# EAGLE design IRIO2 (EAGLE 6.5.0)
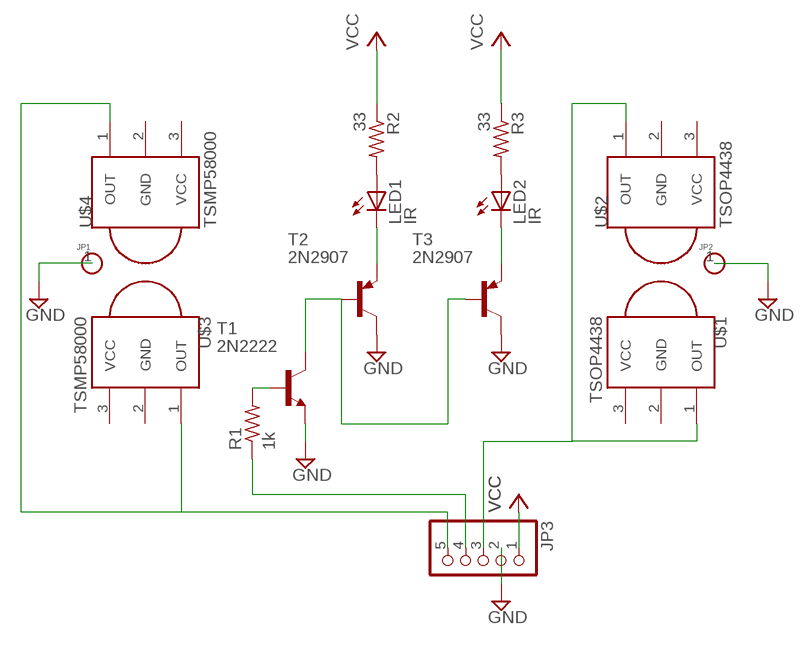
[diagram p0: schematic, sheet 1]

## Parts
JP1  HOLE-DEV  [HOLE-PAH]
JP2  HOLE-DEV  [HOLE-PAH]
JP3  PINHD-1X5  [1X05]
LED1  IR  LED3MM  [LED3MM]
LED2  IR  LED3MM  [LED3MM]
R1  1k  R-US_0207/10  [0207/10]
R2  33  R-US_0204/2V  [0204V]
R3  33  R-US_0204/2V  [0204V]
T1  2N2222  [TO92-EBC-OVAL]
T2  2N2907  [TO92-EBC-OVAL]
T3  2N2907  [TO92-EBC-OVAL]
U$1  TSOP4438  PNA460XM  [PNA460XM]
U$2  TSOP4438  PNA460XM  [PNA460XM]
U$3  TSMP58000  PNA460XM  [PNA460XM]
U$4  TSMP58000  PNA460XM  [PNA460XM]

## Nets
GND: JP1.1 JP2.1 JP3.2 T1.E T2.C T3.C
N$2: JP3.5 U$3.1(OUT) U$4.1(OUT)
N$3: T1.C T2.B T3.B
N$4: R1.2 T1.B
N$5: LED2.K(C) T3.E
N$7: LED1.K(C) T2.E
N$10: LED2.A R3.2
N$11: LED1.A R2.2
N$12: JP3.3 U$1.1(OUT) U$2.1(OUT)
N$14: JP3.4 R1.1
VCC: JP3.1 R2.1 R3.1

## Power pins joined to a net without a drawn wire
GND: U$1.2(GND) U$2.2(GND) U$3.2(GND) U$4.2(GND)
VCC: U$1.3(VCC) U$2.3(VCC) U$3.3(VCC) U$4.3(VCC)

## Library data of the parts
JP1 JP2 = cyborg5:HOLE-DEV: HOLE A hole that you can solder something into.
JP3 = pinhead:PINHD-1X5: PIN HEADER
LED1 LED2 = led:LED: LED OSRAM: - CHIPLED LG R971, LG N971, LY N971, LG Q971, LY Q971, LO R971, LY R971 LH N974, LH R974 LS Q976, LO Q976, LY Q976 LO Q996 - Hyper CHIPLED LW Q18S LB Q993, LB Q99A, LB R99A - SideLED LS A670, LO A670, LY A670, LG A670, LP A670 LB A673, LV A673, LT A673, LW A673 LH A674 LY A675 LS A676, LA A676, LO A676, LY A676, LW A676 LS A679, LY A679, LG A679 - Hyper Micro SIDELED® LS Y876, LA Y876, LO Y876, LY Y876 LT Y87S - SmartLED LW L88C, LW L88S LB L89C, LB L89S, LG L890 LS L89K, LO L89K, LY L89K LS L896, LA L896, LO L896, LY L896 - TOPLED LS T670, LO T670, LY T670, LG T670, LP T670 LSG T670, LSP T670, LSY T670, LOP T670, LYG T670 LG T671, LOG T671, LSG T671 LB T673, LV T673, LT T673, LW T673 LH T674 LS T676, LA T676, LO T676, LY T676, LB T676, LH T676, LSB T676, LW T676 LB T67C, LV T67C, LT T67C, LS T67K, LO T67K, LY T67K, LW E67C LS E67B, LA E67B, LO E67B, LY E67B, LB E67C, LV E67C, LT E67C LW T67C LS T679, LY T679, LG T679 LS T770, LO T770, LY T770, LG T770, LP T770 LB T773, LV T773, LT T773, LW T773 LH T774 LS E675, LA E675, LY E675, LS T675 LS T776, LA T776, LO T776, LY T776, LB T776 LHGB T686 LT T68C, LB T68C - Hyper Mini TOPLED® LB M676 - Mini TOPLED Santana® LG M470 LS M47K, LO M47K, LY M47K Source: http://www.osram.convergy.de LUXEON: - LUMILED® LXK2-PW12-R00, LXK2-PW12-S00, LXK2-PW14-U00, LXK2-PW14-V00 LXK2-PM12-R00, LXK2-PM12-S00, LXK2-PM14-U00 LXK2-PE12-Q00, LXK2-PE12-R00, LXK2-PE12-S00, LXK2-PE14-T00, LXK2-PE14-U00 LXK2-PB12-K00, LXK2-PB12-L00, LXK2-PB12-M00, LXK2-PB14-N00, LXK2-PB14-P00, LXK2-PB14-Q00 LXK2-PR12-L00, LXK2-PR12-M00, LXK2-PR14-Q00, LXK2-PR14-R00 LXK2-PD12-Q00, LXK2-PD12-R00, LXK2-PD12-S00 LXK2-PH12-R00, LXK2-PH12-S00 LXK2-PL12-P00, LXK2-PL12-Q00, LXK2-PL12-R00 Source: www.luxeon.com KINGBRIGHT: KA-3528ASYC Source: www.kingbright.com
R1-R3 = resistor:R-US_: RESISTOR, American symbol
T1 = adafruit:2N2222: NPN TRANSISTOR Big oval pads
T2 T3 = adafruit:2N2907*: PNP Transistor Big Oval pads
U$1-U$4 = adafruit:PNA460XM: IR 38KHz receiver PNA4602 and related receivers http://www.ladyada.net/library/pcb/eaglelibrary.html

## Board
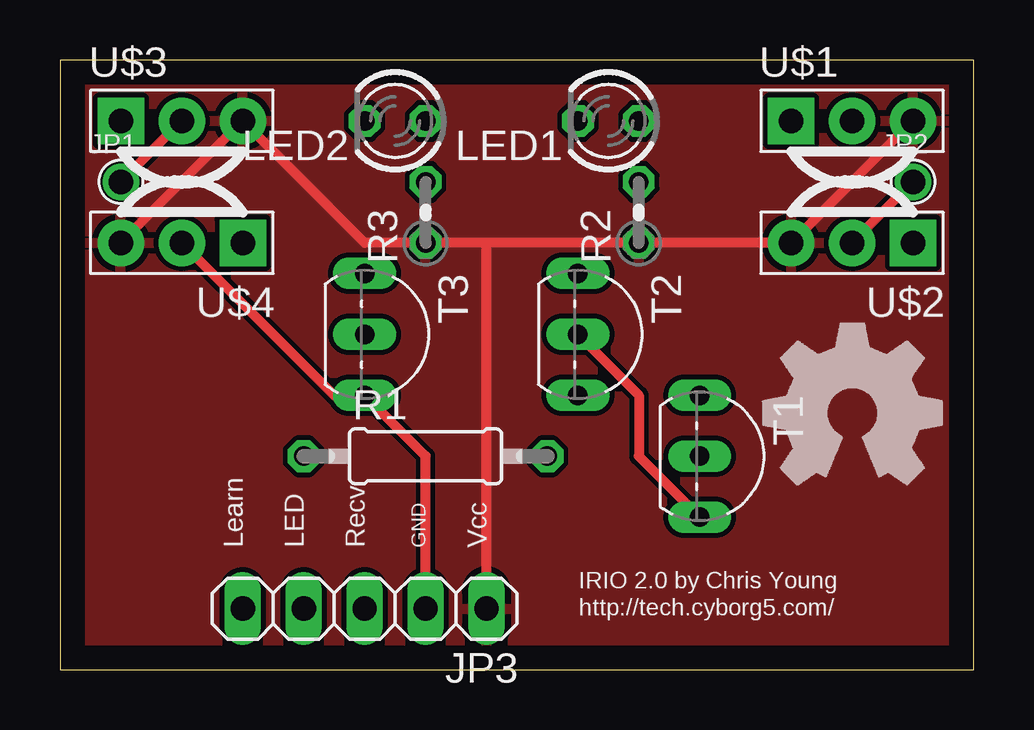
[diagram p1: board, top side]
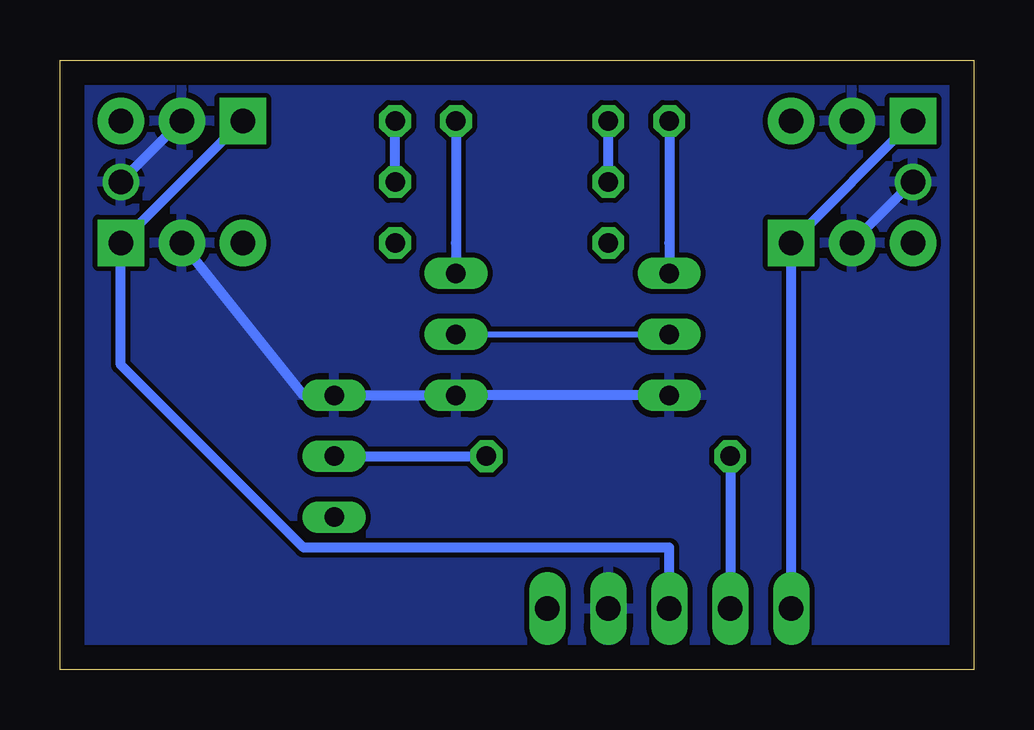
[diagram p2: board, bottom side, seen from below]

Size 38.1 x 25.4 mm. Coordinates in mm from the lower left corner, seen from the top.
Outline: 0,25.4 0,0 38.1,0 38.1,25.4 0,25.4
Copper layers (1*16): Top 0.035mm / dielectric 1.5mm / Bottom 0.035mm
Design rules "default *": minimum track width 10mil, minimum drill 24mil, track to track 8mil, track to pad 8mil, pad to pad 8mil, via to via 8mil, smd to smd 8mil, copper to edge 40mil, drill to drill 8mil, minimum pad ring 10mil, minimum via ring 8mil, stop-mask expansion 4mil, vias tented up to drill 0mil, thermal gap 10mil

### Footprints (pad centres in the part's own frame; a part is rotated, then mirrored left to right if it is on the bottom)
HOLE-PAH = drill 1.016: 1 0,0
1X05 = drill 1.016 long: 1 -5.08,0; 2 -2.54,0; 3 0,0; 4 2.54,0; 5 5.08,0
LED3MM = drill 0.813 octagon: A -1.27,0; K 1.27,0
0207/10 = drill 0.813 octagon: 1 -5.08,0; 2 5.08,0
0204V = drill 0.813 octagon: 1 -1.27,0; 2 1.27,0
TO92-EBC-OVAL = drill 0.813 long: B 0,-1.27; C 2.54,-1.27; E -2.54,-1.27
PNA460XM = drill 1.016 pad 1.93 square: 1 -2.54,0 | drill 1.016 pad 1.93: 2 0,0; 3 2.54,0

### Placement (x,y rotation side)
JP1  2.54,20.32 0 top
JP2  35.56,20.32 0 top
JP3  12.7,2.54 180 top
LED1  22.86,22.86 180 top
LED2  13.97,22.86 180 top
R1  15.24,8.89 0 top
R2  24.13,19.05 90 top
R3  15.24,19.05 90 top
T1  27.94,8.89 270 top
T2  22.86,13.97 270 top
T3  13.97,13.97 270 top
U$1  33.02,22.86 0 top
U$2  33.02,17.78 180 top
U$3  5.08,22.86 0 top
U$4  5.08,17.78 180 top

### Tracks (layer width: path | path; a pad name or v marks a point on that pad's centre or on a via)
GND
  Top 0.406: U$2.2 JP2.1 | U$3.2 JP1.1 | U$4.2 11.43,11.43 T3.C 15.24,8.89 JP3.2
  Bottom 0.406: T3.C T2.C T1.E 27.94,11.43 U$2.2 | JP2.1 U$1.2 | JP1.1 U$4.2
  pour Bottom: 0,25.4 0,0 38.1,0 38.1,25.4
N$2
  Bottom 0.406: U$3.1 U$4.1 JP3.5
N$3
  Top 0.406: T2.B 24.13,11.43 24.13,8.89 T1.C
  Bottom 0.254: T2.B T3.B
N$4
  Bottom 0.406: T1.B R1.2
N$5
  Bottom 0.406: LED2.K 12.7,17.78 T3.E
N$7
  Bottom 0.406: LED1.K 21.59,17.78 T2.E
N$10
  Bottom 0.406: R3.2 LED2.A
N$11
  Bottom 0.406: R2.2 LED1.A
N$12
  Bottom 0.406: U$1.1 U$2.1 35.56,12.7 27.94,5.08 12.7,5.08 JP3.3
N$14
  Bottom 0.406: R1.1 JP3.4
VCC
  Top 0.406: 17.78,17.78 R2.1 U$2.3 U$1.3 | 17.78,17.78 R3.1 12.7,17.78 U$3.3 U$4.3 | JP3.1 17.78,17.78
  pour Top: 0,25.4 0,0 38.1,0 38.1,25.4

### Text on the board
tPlace: Learn | LED | Recv | GND | Vcc | IRIO 2.0 by Chris Young / http://tech.cyborg5.com/